# EAGLE design o2_sensor_interface (EAGLE 9.5.1)
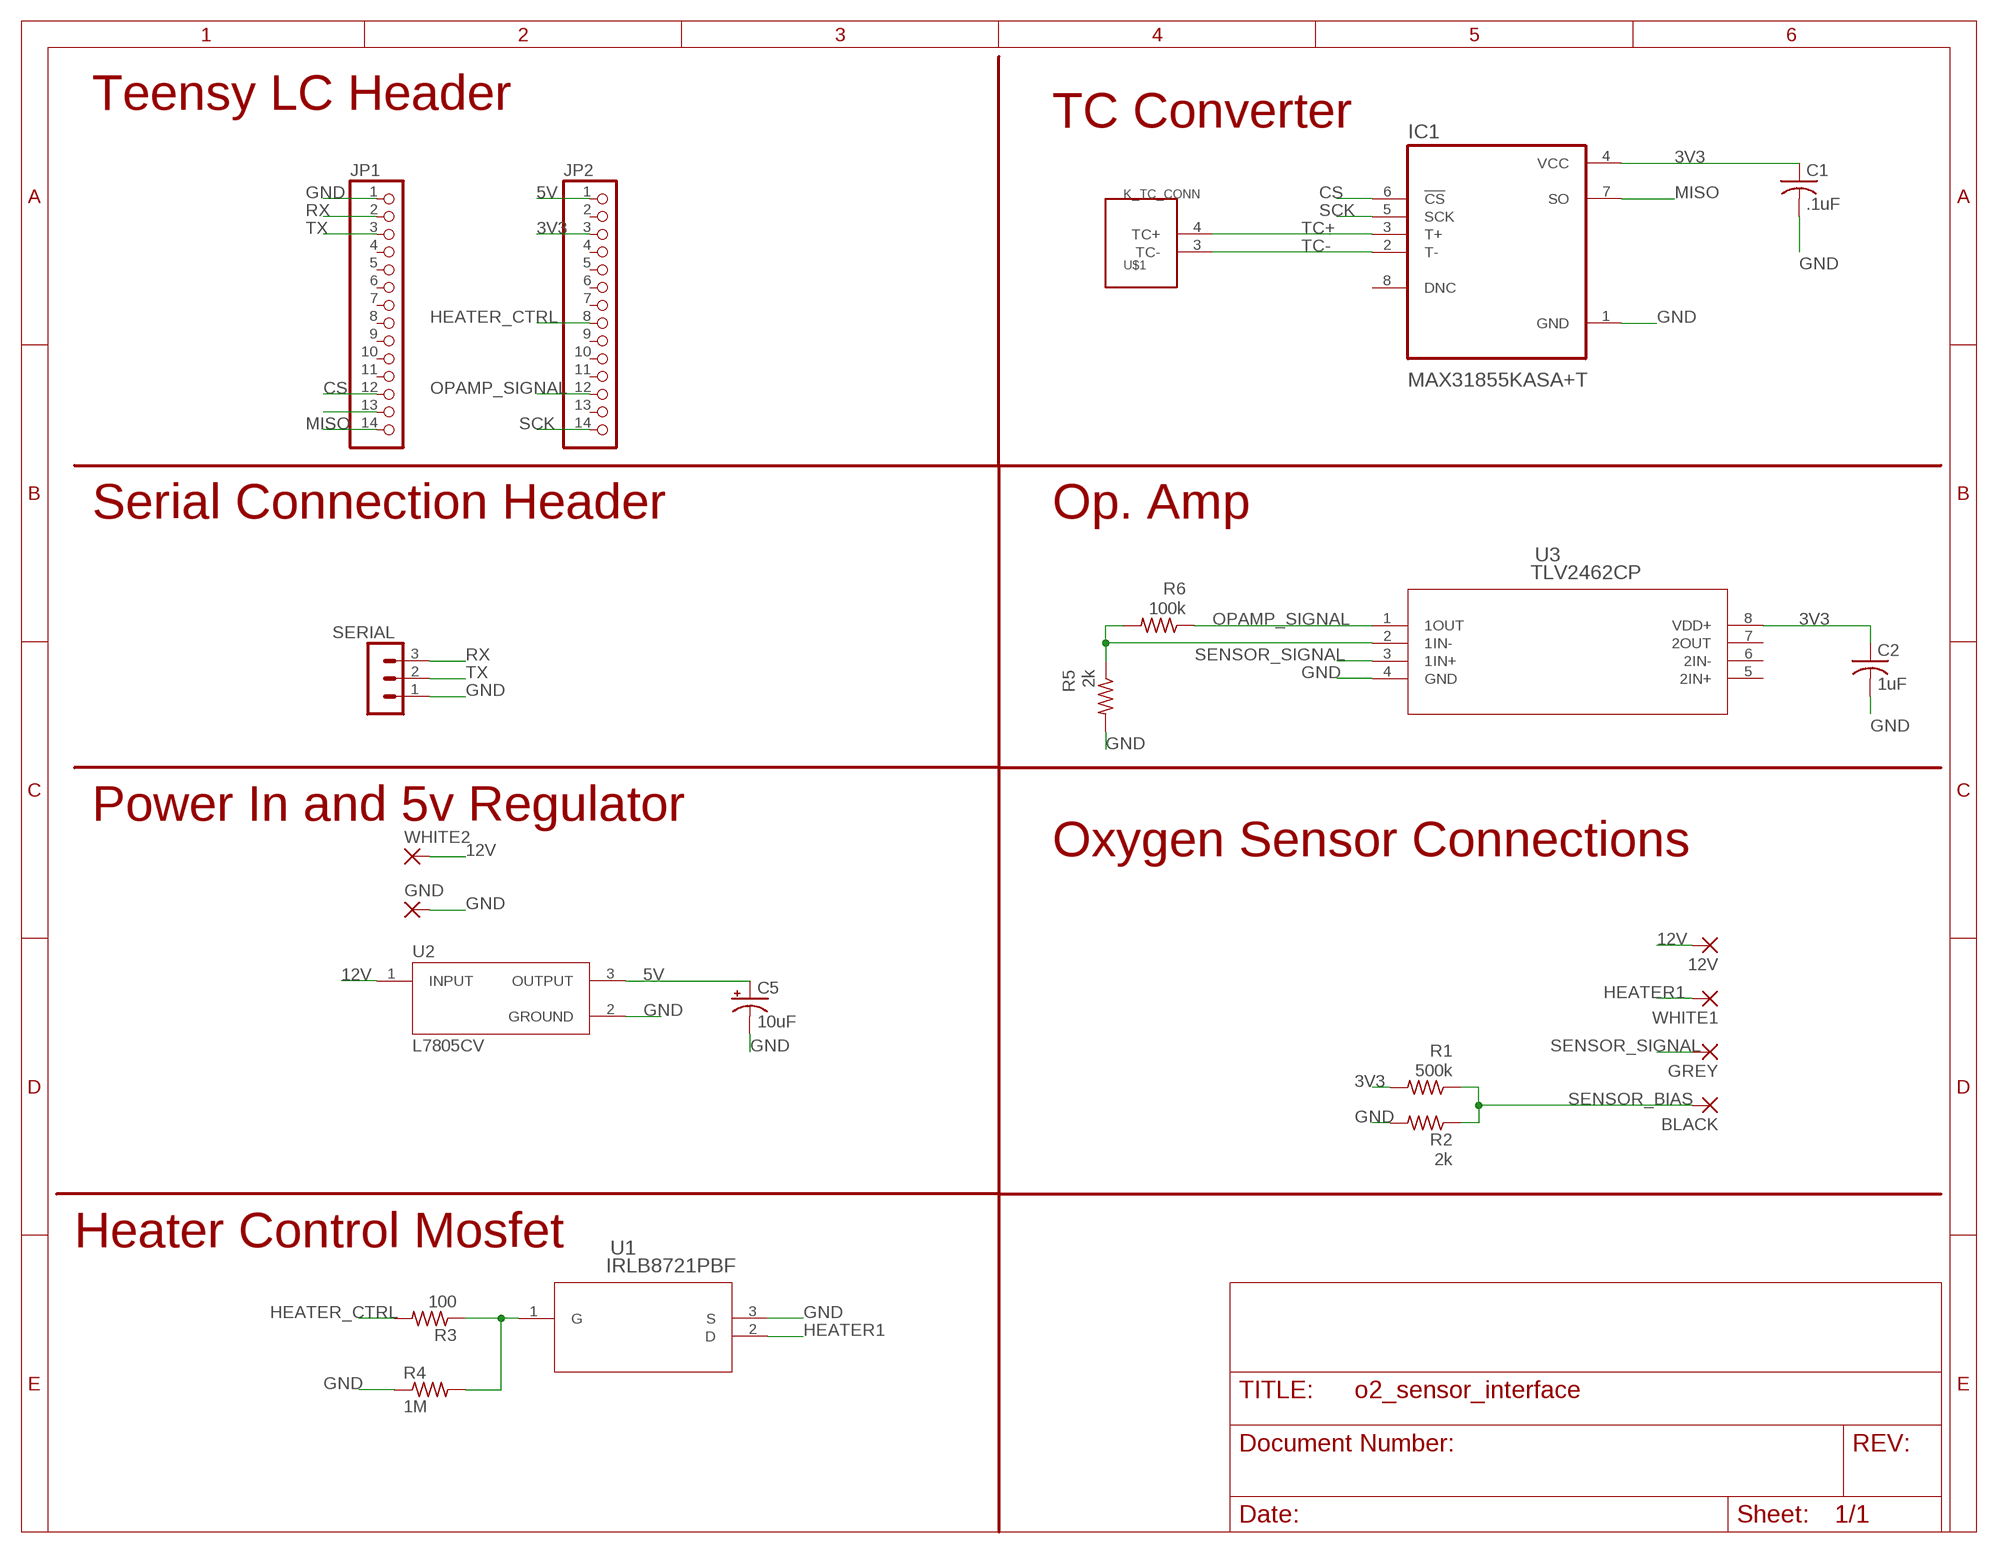
[diagram p0: schematic, sheet 1]

## Parts
12V  3,17/1,3  [3,17/1,3]
BLACK  3,17/1,3  [3,17/1,3]
C1  .1uF  C-US025-030X050  [C025-030X050]
C2  1uF  C-US025-030X050  [C025-030X050]
C5  10uF  CPOL-USE2-4  [E2-4]
GND  3,17/1,3  [3,17/1,3]
GREY  3,17/1,3  [3,17/1,3]
IC1  MAX31855KASA+T  [SOIC127P600X175-8N]
JP1  PINHD-1X14  [1X14]
JP2  PINHD-1X14  [1X14]
R1  500k  R-US_0207/9  [0207/9]
R2  2k  R-US_0207/9  [0207/9]
R3  100  R-US_0207/9  [0207/9]
R4  1M  R-US_0207/9  [0207/9]
R5  2k  R-US_0207/9  [0207/9]
R6  100k  R-US_0207/9  [0207/9]
SERIAL  MA03-1  [MA03-1]
U1  IRLB8721PBF  [PG-TO220-3]
U2  L7805CV  [TO255P1040X460X1968-3]
U3  TLV2462CP  [P8]
U$1  K_TC_CONN  [TC_KTYPE]
WHITE1  3,17/1,3  [3,17/1,3]
WHITE2  3,17/1,3  [3,17/1,3]

## Nets
3V3: C1.1 C2.1 IC1.4(VCC) JP2.3 R1.2 U3.8(VDD+)
5V: C5.+ JP2.1 U2.3(OUTPUT)
12V: 12V.1(P) U2.1(INPUT) WHITE2.1(P)
CS: IC1.6(!CS) JP1.12
GND: C1.2 C2.2 C5.- GND.1(P) IC1.1(GND) JP1.1 R2.2 R4.1 R5.2 SERIAL.1 U1.3(S) U2.2(GROUND) U3.4(GND)
HEATER1: U1.2(D) WHITE1.1(P)
HEATER_CTRL: JP2.8 R3.2
MISO: IC1.7(SO) JP1.14
N$1: R3.1 R4.2 U1.1(G)
N$2: R5.1 R6.2 U3.2(1IN-)
N$4: JP1.13
OPAMP_SIGNAL: JP2.12 R6.1 U3.1(1OUT)
RX: JP1.2 SERIAL.3
SCK: IC1.5(SCK) JP2.14
SENSOR_BIAS: BLACK.1(P) R1.1 R2.1
SENSOR_SIGNAL: GREY.1(P) U3.3(1IN+)
TC+: IC1.3(T+) U$1.4(TC+)
TC-: IC1.2(T-) U$1.3(TC-)
TX: JP1.3 SERIAL.2
Unconnected: IC1.8(DNC) JP1.4 JP1.5 JP1.6 JP1.7 JP1.8 JP1.9 JP1.10 JP1.11 JP2.2 JP2.4 JP2.5 JP2.6 JP2.7 JP2.9 JP2.10 JP2.11 JP2.13 U3.5(2IN+) U3.6(2IN-) U3.7(2OUT)

## Notes on the sheet
- Teensy LC Header
- TC Converter
- Serial Connection Header | Op. Amp
- Power In and 5v Regulator
- Oxygen Sensor Connections
- Heater Control Mosfet

## Library data of the parts
12V BLACK GND GREY WHITE1 WHITE2 = wirepad:3,17/1,3: THROUGH-HOLE PAD
C1 C2 = adafruit:C-US: CAPACITOR, American symbol
C5 = adafruit:CPOL-US: POLARIZED CAPACITOR, American symbol
IC1 = MAX31855KASA_T:MAX31855KASA+T; DESCRIPTION: IC CONV THERMOCOUPLE-DGTL 8SOIC; DIGI-KEY_PART_NUMBER: MAX31855KASA+TCT-ND; DIGI-KEY_PURCHASE_URL: https://www.digikey.com/product-detail/en/maxim-integrated/MAX31855KASA-T/MAX31855KASA-TCT-ND/2708805?utm_source=snapeda&utm_medium=aggregator&utm_campaign=symbol; MF: Maxim Integrated; MP: MAX31855KASA+T; PACKAGE: SOIC-8 Maxim
JP1 JP2 = adafruit:PINHD-1X14: PIN HEADER
R1-R6 = adafruit:R-US_: RESISTOR, American symbol
SERIAL = con-lstb:MA03-1: PIN HEADER; OC_FARNELL: unknown; OC_NEWARK: unknown
U1 = samdg:IRLB8721PBF; BUILT_BY: EMA_UL_Team; COPYRIGHT: Copyright (C) 2018 Accelerated Designs. All rights reserved; MANUFACTURER_PART_NUMBER: IRLB8721PBF; VENDOR: Infineon
U2 = L7805CV:L7805CV: Standard Regulator Pos 5V 1.5A 3-Pin(3+Tab) TO-220 Standard Regulator Pos 5V 1.5A 3-Pin(3+Tab) TO-220; DESCRIPTION: Linear Voltage Regulator IC 1 Output 1.5A TO-220; DIGI-KEY_PART_NUMBER: 497-12404-ND; DIGI-KEY_PURCHASE_URL: https://www.digikey.com/product-detail/en/stmicroelectronics/L7805CV-DG/497-12404-ND/2832888?utm_source=snapeda&utm_medium=aggregator&utm_campaign=symbol; MF: STMicroelectronics; MP: L7805CV; PACKAGE: TO-220 STMicroelectronics
U3 = samdg:TLV2462CP; DATASHEET_URL: http://www.ti.com/lit/gpn/TLV2462; DESCRIPTION: Dual Low-Power, Rail-to-Rail Input/Output Operational Amplifier; FAMILY_NAME: WIDE BANDWIDTH; GENERIC_PART_NUMBER: TLV2462; INDUSTRY_STD_PKG_TYPE: PDIP; MANUFACTURER: Texas Instruments; MANUFACTURER_PART_NUMBER: TLV2462CP; PACKAGE_DESIGNATOR: P; PIN_COUNT: 8; VENDOR: Texas Instruments
U$1 = samdg:K_TC_CONN

## Board
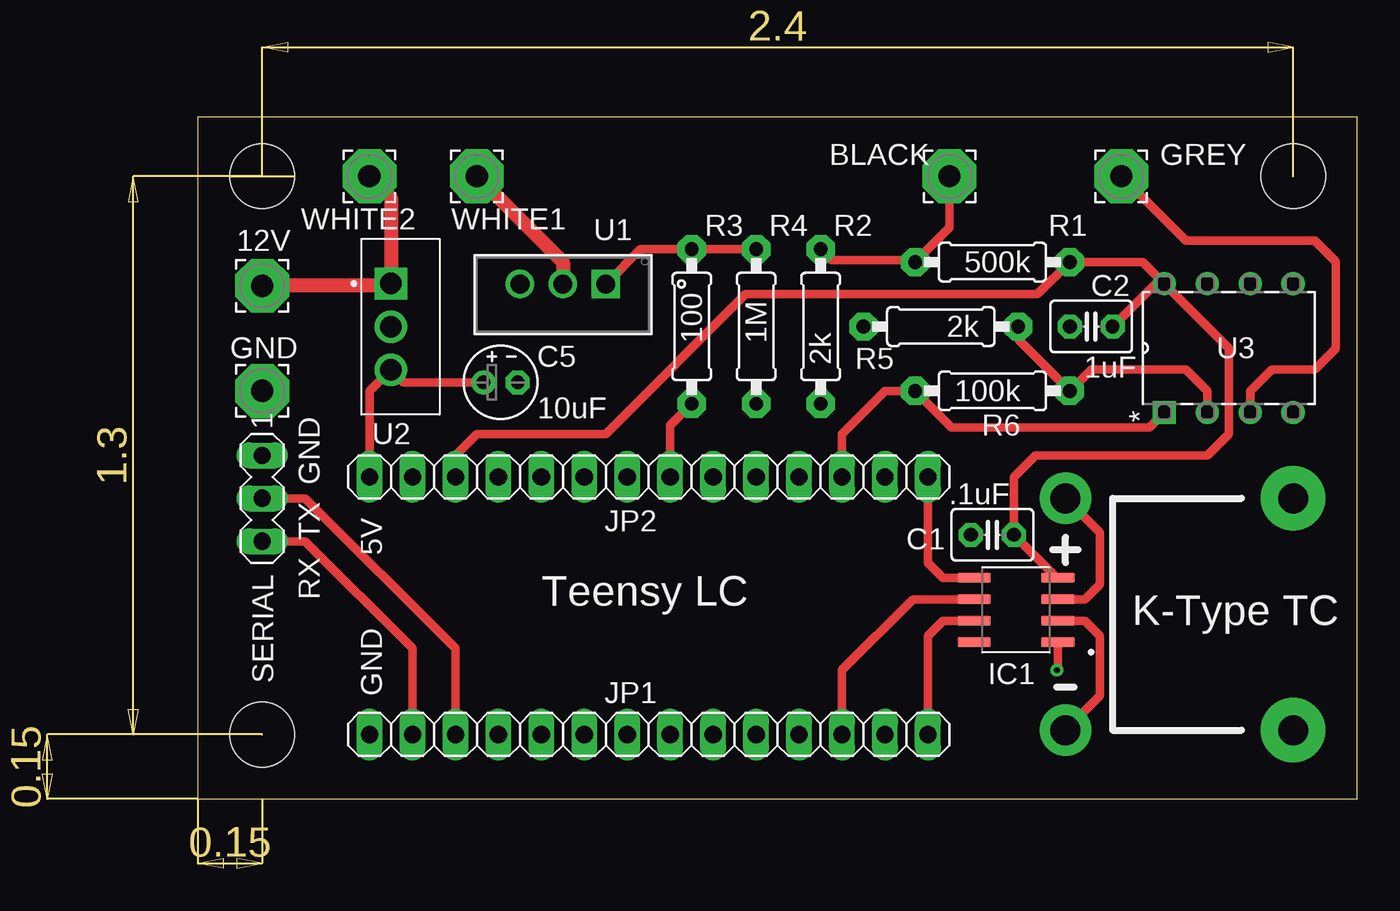
[diagram p1: board, top side]
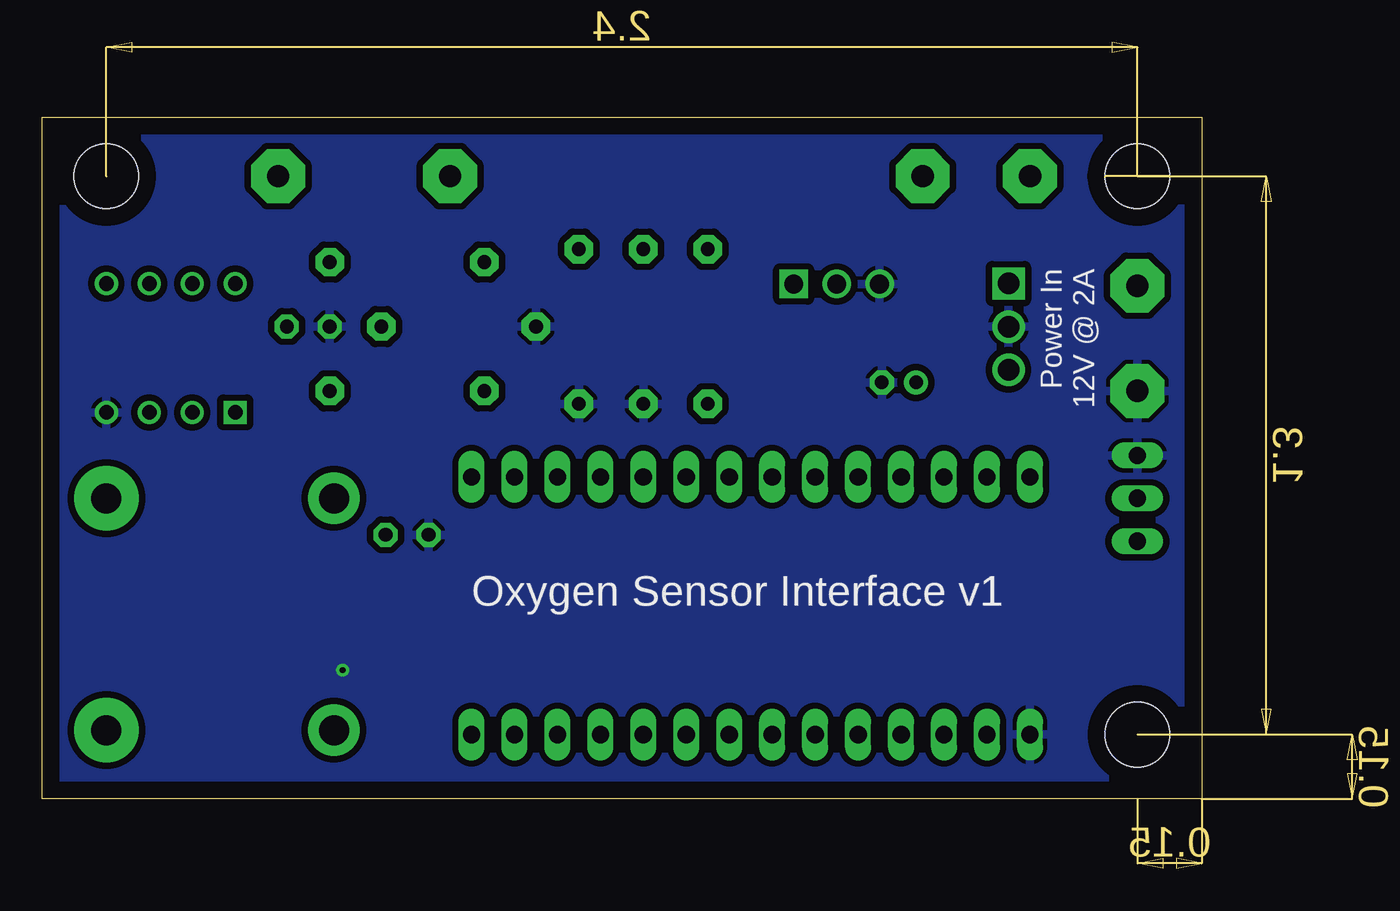
[diagram p2: board, bottom side, seen from below]

Size 68.56 x 40.31 mm. Coordinates in mm from the lower left corner, seen from the top.
Outline: 0,0 68.56,0 68.56,40.31 0,40.31 0,0
Copper layers (1*16): Top 0.035mm / dielectric 1.5mm / Bottom 0.035mm
Design rules "default *": minimum track width 6mil, minimum drill 0.35mm, track to track 6mil, track to pad 6mil, pad to pad 6mil, via to via 6mil, smd to smd 6mil, copper to edge 40mil, drill to drill 6mil, minimum pad ring 10mil, minimum via ring 8mil, stop-mask expansion 13mil, vias tented up to drill 14mil, thermal gap 10mil
Holes 3.81 mm at 3.81,3.81 3.81,36.83 64.77,36.83

### Footprints (pad centres in the part's own frame; a part is rotated, then mirrored left to right if it is on the bottom)
3,17/1,3 = drill 1.321 pad 3.175 octagon: 1 0,0
C025-030X050 = drill 0.813 pad 1.422 octagon: 1 -1.27,0; 2 1.27,0
E2-4 = drill 0.813 pad 1.422: + -1.016,0 | drill 0.813 pad 1.422 octagon: - 1.016,0
SOIC127P600X175-8N = smd 1.97 x 0.59: 1 -2.475,1.905; 2 -2.475,0.635; 3 -2.475,-0.635; 4 -2.475,-1.905; 5 2.475,-1.905; 6 2.475,-0.635; 7 2.475,0.635; 8 2.475,1.905
1X14 = drill 1.016 long: 1 -16.51,0; 2 -13.97,0; 3 -11.43,0; 4 -8.89,0; 5 -6.35,0; 6 -3.81,0; 7 -1.27,0; 8 1.27,0; 9 3.81,0; 10 6.35,0; 11 8.89,0; 12 11.43,0; 13 13.97,0; 14 16.51,0
0207/9 = drill 0.813 pad 1.676 octagon: 1 -4.572,0; 2 4.572,0
MA03-1 = drill 1.016 long: 1 -2.54,0; 2 0,0; 3 2.54,0
PG-TO220-3 = drill 1.118 pad 1.626 square: 1 -5.08,-1.245 | drill 1.118 pad 1.626: 2 -2.54,-1.245; 3 0,-1.245
TO255P1040X460X1968-3 = drill 1.27 pad 1.91 square: 1 0,0 | drill 1.27 pad 1.91: 2 2.55,0; 3 5.1,0
P8 = drill 0.864 pad 1.372 square: 1 -7.62,7.62 | drill 0.864 pad 1.372: 2 -7.62,5.08; 3 -7.62,2.54; 4 -7.62,0; 5 0,0; 6 0,2.54; 7 0,5.08; 8 0,7.62
TC_KTYPE = drill 1.778 pad 3.81: 1 0,13.716; 2 0,0 | drill 1.778 pad 3.048: 3 13.462,13.716; 4 13.462,0

### Placement (x,y rotation side)
12V  3.81,30.35 0 top
BLACK  44.45,36.83 0 top
C1  46.99,15.62 180 top
C2  52.83,27.94 180 top
C5  17.91,24.64 0 top
GND  3.81,24.13 0 top
GREY  54.61,36.83 0 top
IC1  48.39,11.18 180 top
JP1  26.67,3.81 0 top
JP2  26.67,19.05 0 top
R1  46.99,31.75 0 top
R2  36.83,27.94 270 top
R3  29.21,27.94 270 top
R4  33.02,27.94 90 top
R5  43.94,27.94 180 top
R6  46.99,24.13 0 top
SERIAL  3.81,17.78 270 top
U1  19.05,29.21 180 top
U2  11.43,30.48 270 top
U3  64.77,30.48 90 top
U$1  64.77,17.78 180 top
WHITE1  16.51,36.83 0 top
WHITE2  10.16,36.83 0 top

### Tracks (layer width: path | path; a pad name or v marks a point on that pad's centre or on a via)
3V3
  Top 0.508: JP2.3 15.24,20.32 16.51,21.59 24.13,21.59 32.38,29.84 49.66,29.84 R1.2 55.88,31.75 U3.8 | U3.8 60.96,26.67 60.96,21.59 59.69,20.32 49.53,20.32 48.26,19.05 C1.1 50.8,13.08 IC1.4 | C2.1 56.64,30.48 U3.8
5V
  Top 0.508: JP2.1 10.16,24.11 U2.3 12.17,24.64 C5.+
12V
  Top 0.813: 12V.1 11.3,30.35 U2.1 11.43,35.56 WHITE2.1
CS
  Top 0.508: JP1.12 38.1,7.62 42.29,11.81 IC1.6
GND  (via drill 0.35)
  Top 0.508: IC1.1 50.86,7.68 v50.8,7.62
  pour Bottom (isolate 0.381): 0,40.64 68.58,40.64 68.58,0 0,0
HEATER1
  Top 0.813: WHITE1.1 21.59,31.75 U1.2
HEATER_CTRL
  Top 0.508: R3.2 27.94,22.1 JP2.8
MISO
  Top 0.508: IC1.7 44.07,10.54 43.18,9.65 JP1.14
N$1
  Top 0.508: R3.1 28.7,32.51 | R3.1 R4.2 | U1.1 26.19,32.51 R3.1
N$2
  Top 0.508: R5.1 48.51,27.18 R6.2 52.83,25.4 58.42,25.4 59.69,24.13 U3.2
OPAMP_SIGNAL
  Top 0.508: JP2.12 38.1,21.59 40.64,24.13 R6.1 44.58,21.97 56.26,21.97 U3.1
RX
  Top 0.508: SERIAL.3 6.35,15.24 12.7,8.89 JP1.2
SCK
  Top 0.508: JP2.14 43.18,13.97 44.07,13.08 IC1.5
SENSOR_BIAS
  Top 0.508: R2.1 37.47,31.88 42.29,31.88 R1.1 44.45,33.78 BLACK.1
SENSOR_SIGNAL
  Top 0.508: GREY.1 58.42,33.02 66.04,33.02 67.29,31.77 67.29,26.65 66.04,25.4 63.5,25.4 62.23,24.13 U3.3
TC+
  Top 0.508: U$1.4 53.34,15.75 53.34,12.7 52.45,11.81 IC1.3
TC-
  Top 0.508: U$1.3 53.34,6.1 53.34,9.65 52.45,10.54 IC1.2
TX
  Top 0.508: SERIAL.2 6.35,17.78 15.24,8.89 JP1.3

### Text on the board
tNames: RX TX GND | 5V | Teensy LC | K-Type TC | GND
bNames: Power In / 12V @ 2A | Oxygen Sensor Interface v1